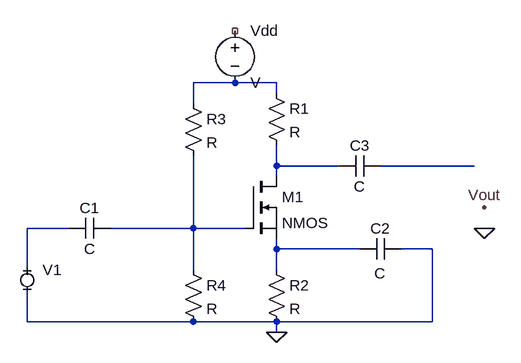
[diagram p0: schematic CS_S20210020323.asc]
CS_S20210020323.asc, the LTspice schematic file:
Version 4
SHEET 1 880 680
WIRE 176 -16 112 -16
WIRE 240 -16 176 -16
WIRE 240 0 240 -16
WIRE 112 16 112 -16
WIRE 240 112 240 80
WIRE 336 112 240 112
WIRE 544 112 400 112
WIRE 240 128 240 112
WIRE -80 208 -144 208
WIRE 112 208 112 96
WIRE 112 208 -16 208
WIRE 192 208 112 208
WIRE 240 240 240 224
WIRE 368 240 240 240
WIRE 480 240 432 240
WIRE -144 272 -144 208
WIRE 112 272 112 208
WIRE 240 272 240 240
WIRE -144 352 -144 304
WIRE 112 352 -144 352
WIRE 240 352 112 352
WIRE 480 352 480 240
WIRE 480 352 240 352
WIRE 240 368 240 352
FLAG 240 368 0
FLAG 560 208 0
FLAG 560 176 Vout
SYMBOL res 224 -16 R0
SYMATTR InstName R1
SYMBOL res 224 256 R0
SYMATTR InstName R2
SYMBOL sym\\ZZZ\\MiniSyms4\\voltage- -144 288 R0
SYMATTR InstName V1
SYMBOL nmos 192 128 R0
SYMATTR InstName M1
SYMBOL cap -16 192 R90
WINDOW 0 0 32 VBottom 2
WINDOW 3 32 32 VTop 2
SYMATTR InstName C1
SYMBOL cap 432 224 R90
WINDOW 0 0 32 VBottom 2
WINDOW 3 38 33 VTop 2
SYMATTR InstName C2
SYMBOL cap 400 96 R90
WINDOW 0 0 32 VBottom 2
WINDOW 3 32 32 VTop 2
SYMATTR InstName C3
SYMBOL res 96 0 R0
SYMATTR InstName R3
SYMBOL res 96 256 R0
SYMATTR InstName R4
SYMBOL voltage 176 -112 R0
SYMATTR InstName Vdd

The netlist it stands for:
* CS_S20210020323.asc
R1 N001 N002 R
R2 N006 0 R
V1 N004 0
M1 N002 N005 N006 N006 NMOS
C1 N005 N004 C
C2 0 N006 C
C3 N003 N002 C
R3 N001 N005 R
R4 N005 0 R
Vdd NC_01 N001 V
.model NMOS NMOS
.model PMOS PMOS
.lib standard.mos
.backanno
.end